# Altium schematic sheet Channel_2.SchDoc
size A4
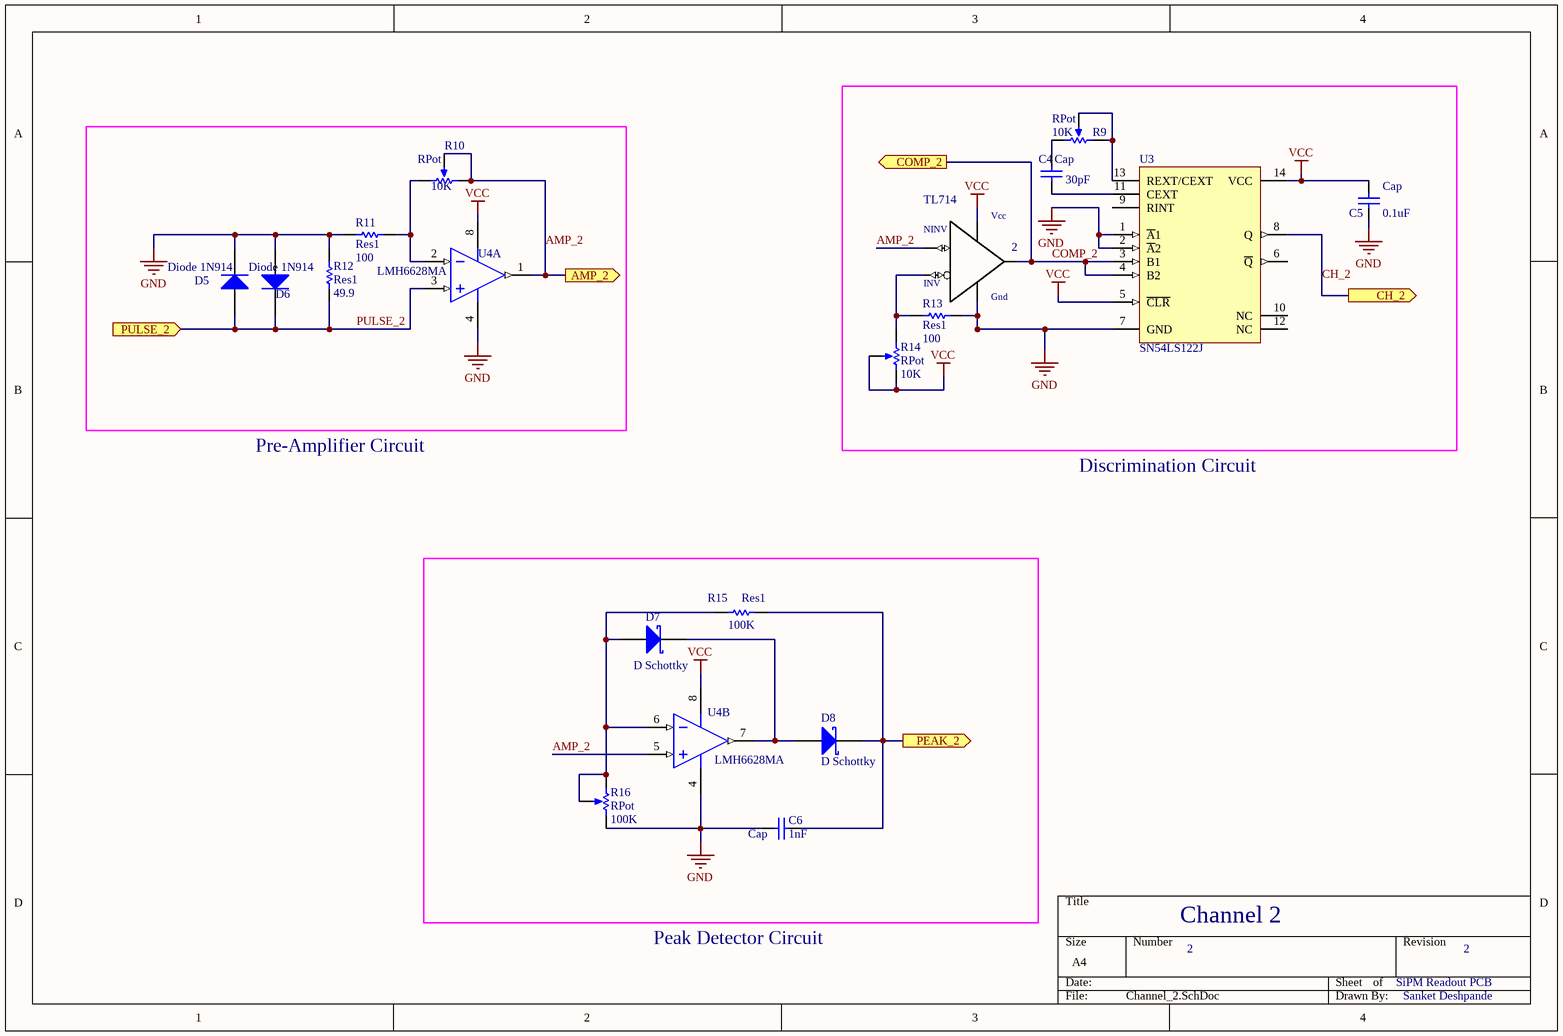
[diagram p0: Channel_2.SchDoc]

## Parts
2  TL714  [SO-08M]
C4  Cap  value 30pF  [RAD-0.3]
C5  Cap  value 0.1uF  [RAD-0.3]
C6  Cap  value 1nF  [RAD-0.3]
D5  Diode 1N914  [DO-35]
D6  Diode 1N914  [DO-35]
D7  D Schottky  [SMB]
D8  D Schottky  [SMB]
R9  RPot  value 10K  [VR5]
R10  RPot  value 10K  [VR5]
R11  Res1  value 100  [AXIAL-0.3]
R12  Res1  value 49.9  [AXIAL-0.3]
R13  Res1  value 100  [AXIAL-0.3]
R14  RPot  value 10K  [VR5]
R15  Res1  value 100K  [AXIAL-0.3]
R16  RPot  value 100K  [VR5]
U3  SN54LS122J  [J014]
U4  LMH6628MA  [M08A_N]  (parts A,B of 2)

## Ports
AMP_2 (out), CH_2 (out), COMP_2 (out), PEAK_2 (out), PULSE_2 (in)

## Nets
GND: 2.5(VNEG) C5.1 C6.1 D5.2(K) D6.1(A) R11.1 R12.1 R13.2 R16.2(BOT) U3.1(~{A}1) U3.2(~{A}2) U3.7(GND) U4.4(V-)
VCC: 2.8(VPOS) C5.2 R14.2(BOT) R14.3(TAP) U3.5(~{CLR}) U3.14(VCC) U4.8(V+)
AMP_2: 2.3(NINV) R10.1(TOP) R10.3(TAP) U4.1(OUT1) U4.5(IN2+) ; port AMP_2
CH_2: U3.8(Q) ; port CH_2
COMP_2: 2.6(OUT) U3.3(B1) U3.4(B2) ; port COMP_2
PEAK_2: C6.2 D8.2(K) R15.2 ; port PEAK_2
PULSE_2: D5.1(A) D6.2(K) R12.2 U4.3(IN1+) ; port PULSE_2
Net2_2: 2.2(INV) R13.1 R14.1(TOP)
NetC4_1: C4.1 U3.11(CEXT)
NetC4_2: C4.2 R9.2(BOT)
NetD7_1: D7.1(A) R15.1 R16.1(TOP) R16.3(TAP) U4.6(IN2-)
NetD7_2: D7.2(K) D8.1(A) U4.7(OUT2)
NetR9_1: R9.1(TOP) R9.3(TAP) U3.13(REXT/CEXT)
NetR10_2: R10.2(BOT) R11.2 U4.2(IN1-)

Not connected (* = marked no-connect by the designer): U3 6(~{Q}) 9(RINT) 10(NC) 12(NC)

## Notes on the sheet
- Pre-Amplifier Circuit
- Discrimination Circuit
- Peak Detector Circuit
- Channel 2
- 2
- SiPM Readout PCB
- Sanket Deshpande
- (in symbol TL714) Vcc; Gnd

## Library data of the parts
2 = TL714: The TL714C is a high-speed differential comparator fabricated with bipolar Schottky process technology. The circuit h...; MF: Texas Instruments; SnapEDA_Link: https://www.snapeda.com/parts/TL714/Texas%20Instruments/view-part/?ref=snap; Availability: Unavailable; MP: TL714; Package: None; Price: None; Value: *
C4-C6 = Cap: Capacitor; Published: 8-Jun-2000; LatestRevisionDate: 17-Jul-2002; LatestRevisionNote: Re-released for DXP Platform.; PackageReference: RAD-0.3; Publisher: Altium Limited; PackageDescription: Radial Cap, Thru-Hole; 2 Leads; 0.3 in Pin Spacing
D5 D6 = Diode 1N914: High Conductance Fast Diode; Published: 8-Jun-2000; LatestRevisionDate: 17-Jul-2002; LatestRevisionNote: Re-released for DXP Platform.; DatasheetVersion: 1997; PackageReference: DO-35; Publisher: Altium Limited; PackageDescription: Diode, Axial; Body 3.8 x 1.9 mm (LxDia. max), Lead Dia. 0.53 mm (max); Code_JEDEC: DO-204-AH; ComponentLink1Description: Manufacturer Link; ComponentLink1URL: http://www.fairchildsemi.com/; ComponentLink2Description: Datasheet; ComponentLink2URL: http://www.fairchildsemi.com/ds/1N%2F1N4448.pdf
D7 D8 = D Schottky: Schottky Diode; Published: 8-Jun-2000; LatestRevisionDate: 17-Jul-2002; LatestRevisionNote: Re-released for DXP Platform.; PackageReference: SMB; Publisher: Altium Limited; PackageDescription: DO-214-AA/SMB; 2 C-Bend Leads; Body 5.3 x 3.6 mm, inc. leads (LxW); Code_JEDEC: DO-214-AA
R9 R10 R14 R16 = RPot: Potentiometer; Sim Note: Enter the Resistance value and the set point into parameter fields.; Set Position: 0.5; Published: 8-Jun-2000; LatestRevisionDate: 17-Jul-2002; LatestRevisionNote: Re-released for DXP Platform.; PackageReference: VR5; Publisher: Altium Limited; PackageDescription: Variable Resistor, Thru-Hole; 3 Leads
R11-R13 R15 = Res1: Resistor; Published: 8-Jun-2000; LatestRevisionDate: 17-Jul-2002; LatestRevisionNote: Re-released for DXP Platform.; PackageReference: AXIAL-0.3; Publisher: Altium Limited; PackageDescription: Axial Device, Thru-Hole; 2 Leads; 0.3 in Pin Spacing
U3 = SN54LS122J: Retriggerable Monostable Multivibrator; Note: Pins No 10 and 12 are not connected and not drawn; Published: 8-Jun-2000; LatestRevisionDate: 04-Mar-2005; LatestRevisionNote: Stylized 3D Model Added.; DatasheetVersion: Mar-1988; PackageVersion: Jun-1999; PackageReference: J014; Publisher: Altium Limited; PackageDescription: DIP; 14 Leads; Row Spacing 7.62 mm; Pitch 2.54 mm; ComponentLink1Description: Manufacturer Link; ComponentLink1URL: http://www.ti.com/; ComponentLink2Description: Datasheet; ComponentLink2URL: http://www-s.ti.com/sc/ds/sn54ls123.pdf
U4 = LMH6628MA: Dual Wideband, Low Noise, Voltage Feedback Op Amp, 8-pin Narrow SOIC; Manufacturer: National Semiconductor; PackageTopMarking: NSZXTT*LMH66*28MA; PowerWise: Y; CompType: Amplifiers; DatasheetVersion: May-2005; PackageVersion: revM, May-2009; PackageReference: M08A; PackageDescription: SOIC Narrow, 4.9 x 3.9 x 1.45mm, 8 Lead, 1.27mm Pitch; PartNumber: LMH6628MA; RoHS: N; PinCount: 8; High-Reliability: Y; Code_JEDEC: MS-012-AA; Code_IPC: SOIC127P600-8; ComponentLink1Description: Manufacturer URL; ComponentLink1URL: http://www.national.com/; ComponentLink2Description: LMH6628 Datasheet; ComponentLink2URL: http://www.national.com/ds/LM/LMH6628.pdf; ComponentLink3Description: LMH6628 Web Page; ComponentLink3URL: http://www.national.com/pf/LM/LMH6628.html; ComponentLink4Description: M08A Package Page; ComponentLink4URL: http://www.national.com/packaging/folders/m08a.html